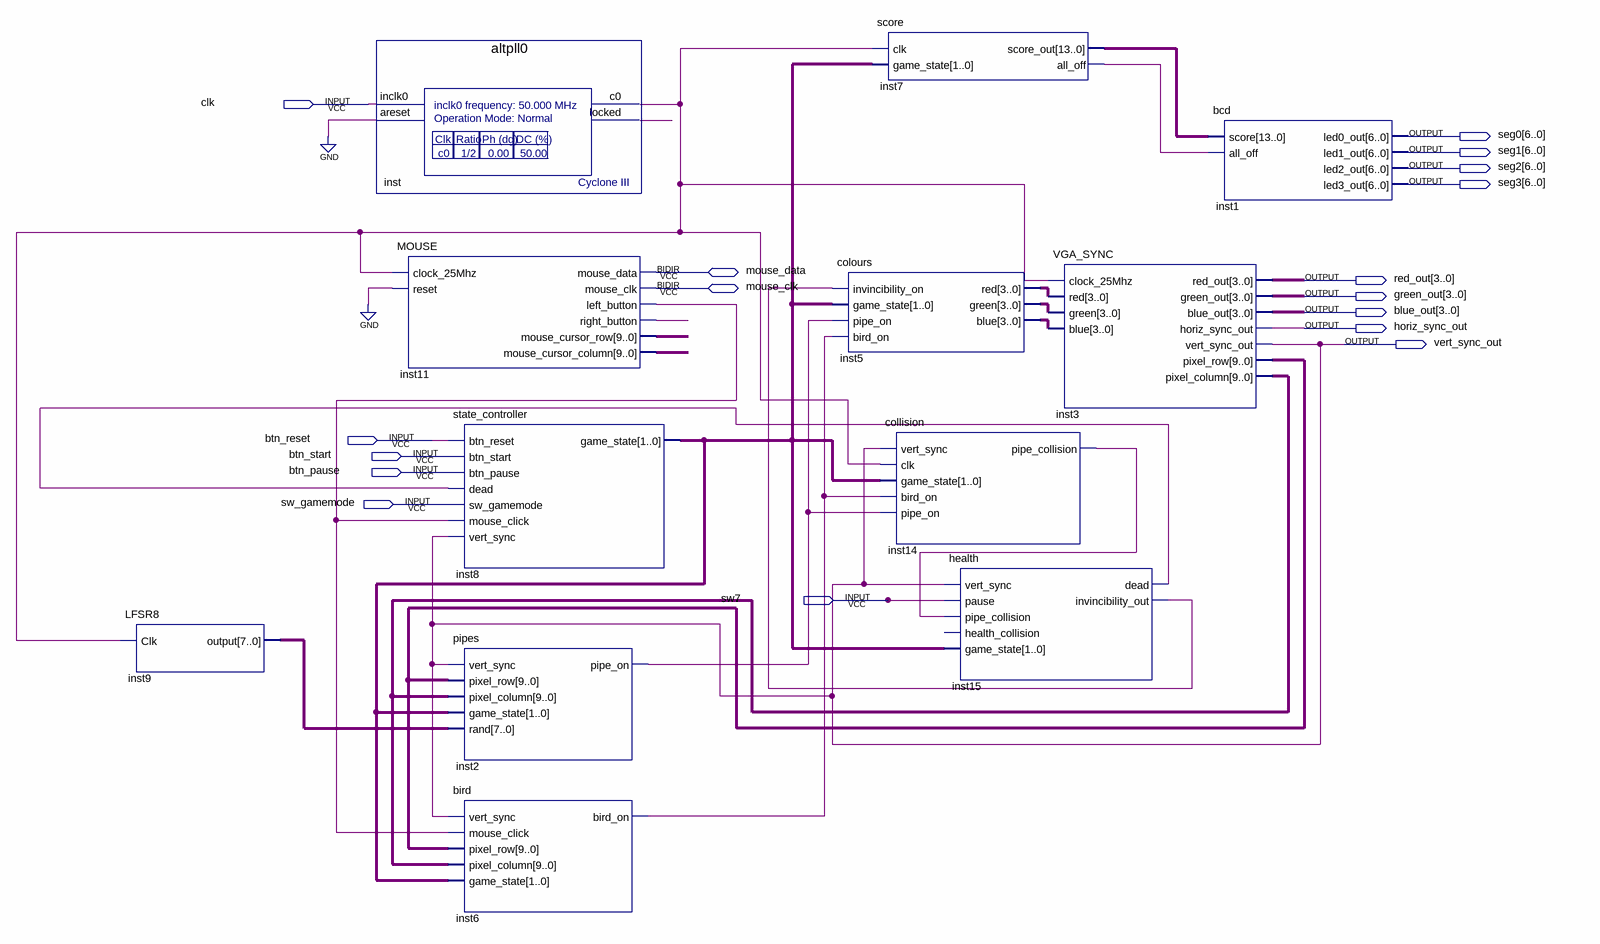
[diagram p0: schematic sheet]
// Quartus schematic mini_project.bdf as structural Verilog: 12 symbols, 17 pins
module mini_project (
  input  clk,
  input  btn_reset,
  input  btn_start,
  input  btn_pause,
  input  sw_gamemode,
  input  sw7,
  inout  mouse_data,
  inout  mouse_clk,
  output [6:0] seg0,
  output [6:0] seg1,
  output [6:0] seg2,
  output [6:0] seg3,
  output [3:0] red_out,
  output [3:0] green_out,
  output [3:0] blue_out,
  output horiz_sync_out,
  output vert_sync_out
);

  wire inst2_pipe_on, inst6_bird_on, inst7_all_off, inst11_left_button, inst11_right_button,
       inst14_pipe_collision, inst15_dead, inst15_invincibility_out, inst_c0, inst_locked;
  wire [1:0] inst8_game_state;
  wire [3:0] inst5_blue, inst5_green, inst5_red;
  wire [7:0] inst9_output;
  wire [9:0] inst3_pixel_column, inst3_pixel_row, inst11_mouse_cursor_column, inst11_mouse_cursor_row;
  wire [13:0] inst7_score_out;

  LFSR8 inst9 (.Clk(inst_c0), .\output (inst9_output));
  altpll0 inst (.inclk0(clk), .areset(1'b0), .c0(inst_c0), .locked(inst_locked));
  MOUSE inst11 (
    .clock_25Mhz(inst_c0), .reset(1'b0), .left_button(inst11_left_button),
    .right_button(inst11_right_button), .mouse_cursor_row(inst11_mouse_cursor_row),
    .mouse_cursor_column(inst11_mouse_cursor_column), .mouse_data(mouse_data), .mouse_clk(mouse_clk));
  state_controller inst8 (
    .btn_reset(btn_reset), .dead(inst15_dead), .sw_gamemode(sw_gamemode), .mouse_click(inst11_left_button),
    .vert_sync(vert_sync_out), .game_state(inst8_game_state));  // open: btn_start, btn_pause
  pipes inst2 (
    .vert_sync(vert_sync_out), .pixel_row(inst3_pixel_row), .pixel_column(inst3_pixel_column),
    .game_state(inst8_game_state), .\rand (inst9_output), .pipe_on(inst2_pipe_on));
  bird inst6 (
    .vert_sync(vert_sync_out), .mouse_click(inst11_left_button), .pixel_row(inst3_pixel_row),
    .pixel_column(inst3_pixel_column), .game_state(inst8_game_state), .bird_on(inst6_bird_on));
  colours inst5 (
    .invincibility_on(inst15_invincibility_out), .game_state(inst8_game_state), .pipe_on(inst2_pipe_on),
    .bird_on(inst6_bird_on), .red(inst5_red), .green(inst5_green), .blue(inst5_blue));
  score inst7 (.clk(inst_c0), .game_state(inst8_game_state), .score_out(inst7_score_out), .all_off(inst7_all_off));
  collision inst14 (
    .vert_sync(vert_sync_out), .clk(inst_c0), .game_state(inst8_game_state), .bird_on(inst6_bird_on),
    .pipe_on(inst2_pipe_on), .pipe_collision(inst14_pipe_collision));
  health inst15 (
    .vert_sync(vert_sync_out), .pause(sw7), .pipe_collision(inst14_pipe_collision),
    .game_state(inst8_game_state), .dead(inst15_dead), .invincibility_out(inst15_invincibility_out));  // open: health_collision
  VGA_SYNC inst3 (
    .clock_25Mhz(inst_c0), .red(inst5_red), .green(inst5_green), .blue(inst5_blue), .red_out(red_out),
    .green_out(green_out), .blue_out(blue_out), .horiz_sync_out(horiz_sync_out),
    .vert_sync_out(vert_sync_out), .pixel_row(inst3_pixel_row), .pixel_column(inst3_pixel_column));
  bcd inst1 (
    .score(inst7_score_out), .all_off(inst7_all_off), .led0_out(seg0), .led1_out(seg1), .led2_out(seg2),
    .led3_out(seg3));
endmodule
